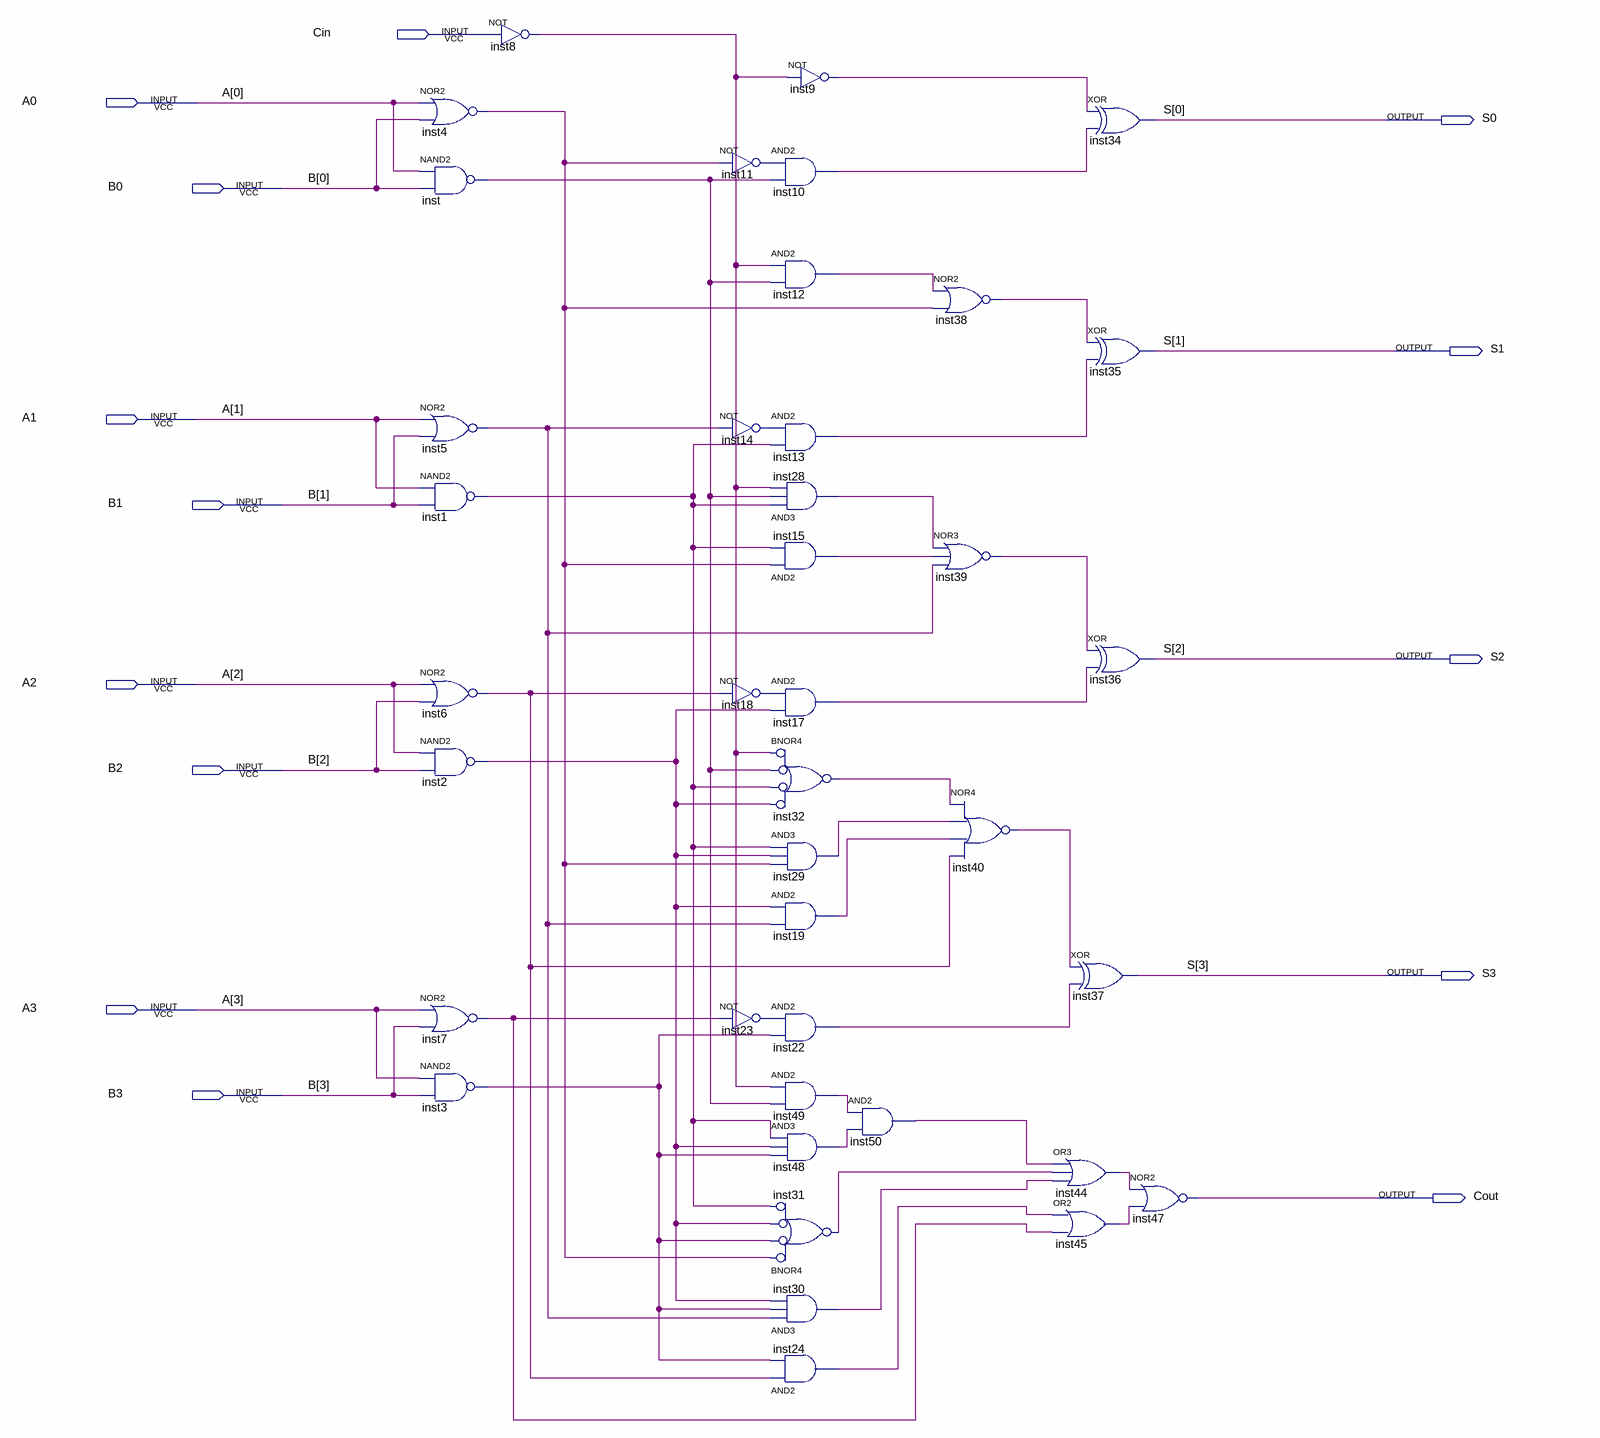
[diagram p0: schematic sheet]
// Quartus schematic sum_look_ahead.bdf as structural Verilog: 40 symbols, 14 pins
module sum_look_ahead (
  input  Cin,
  input  A0,
  input  B0,
  input  A1,
  input  B1,
  input  A2,
  input  B2,
  input  A3,
  input  B3,
  output S0,
  output S1,
  output S2,
  output S3,
  output Cout
);

  wire inst1_out, inst2_out, inst3_out, inst4_out, inst5_out, inst6_out, inst7_out, inst8_out, inst9_out,
       inst10_out, inst11_out, inst12_out, inst13_out, inst14_out, inst15_out, inst17_out, inst18_out,
       inst19_out, inst22_out, inst23_out, inst24_out, inst28_out, inst29_out, inst30_out, inst31_out,
       inst32_out, inst38_out, inst39_out, inst40_out, inst44_out, inst45_out, inst48_out, inst49_out,
       inst50_out, inst_out;

  nor inst4 (inst4_out, A0, B0);
  nand inst (inst_out, A0, B0);
  nor inst5 (inst5_out, A1, B1);
  nand inst1 (inst1_out, A1, B1);
  nor inst6 (inst6_out, A2, B2);
  nand inst2 (inst2_out, A2, B2);
  nor inst7 (inst7_out, A3, B3);
  nand inst3 (inst3_out, A3, B3);
  not inst8 (inst8_out, Cin);
  and inst10 (inst10_out, inst11_out, inst_out);
  not inst11 (inst11_out, inst4_out);
  and inst12 (inst12_out, inst8_out, inst_out);
  and inst13 (inst13_out, inst14_out, inst1_out);
  not inst14 (inst14_out, inst5_out);
  and inst28 (inst28_out, inst1_out, inst_out, inst8_out);
  and inst15 (inst15_out, inst4_out, inst1_out);
  and inst17 (inst17_out, inst18_out, inst2_out);
  not inst18 (inst18_out, inst6_out);
  nor inst32 (inst32_out, ~inst8_out, ~inst_out, ~inst1_out, ~inst2_out);  // BNOR4
  and inst29 (inst29_out, inst1_out, inst2_out, inst4_out);
  and inst19 (inst19_out, inst2_out, inst5_out);
  and inst22 (inst22_out, inst23_out, inst3_out);
  not inst23 (inst23_out, inst7_out);
  and inst49 (inst49_out, inst8_out, inst_out);
  and inst48 (inst48_out, inst1_out, inst2_out, inst3_out);
  nor inst31 (inst31_out, ~inst4_out, ~inst3_out, ~inst2_out, ~inst1_out);  // BNOR4
  and inst30 (inst30_out, inst5_out, inst3_out, inst2_out);
  and inst24 (inst24_out, inst6_out, inst3_out);
  not inst9 (inst9_out, inst8_out);
  and inst50 (inst50_out, inst49_out, inst48_out);
  nor inst38 (inst38_out, inst12_out, inst4_out);
  nor inst39 (inst39_out, inst28_out, inst15_out, inst5_out);
  nor inst40 (inst40_out, inst32_out, inst29_out, inst19_out, inst6_out);
  xor inst34 (S0, inst9_out, inst10_out);
  xor inst35 (S1, inst38_out, inst13_out);
  xor inst36 (S2, inst39_out, inst17_out);
  xor inst37 (S3, inst40_out, inst22_out);
  or inst44 (inst44_out, inst50_out, inst31_out, inst30_out);
  or inst45 (inst45_out, inst24_out, inst7_out);
  nor inst47 (Cout, inst44_out, inst45_out);
endmodule
